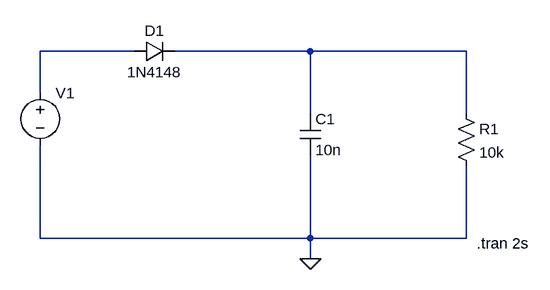
[diagram p0: schematic Diodo.asc]
Diodo.asc, the LTspice schematic file:
Version 4
SHEET 1 880 680
WIRE 112 160 -32 160
WIRE 384 160 176 160
WIRE 624 160 384 160
WIRE -32 224 -32 160
WIRE 384 256 384 160
WIRE 624 256 624 160
WIRE -32 448 -32 304
WIRE 384 448 384 320
WIRE 384 448 -32 448
WIRE 624 448 624 336
WIRE 624 448 384 448
WIRE 384 480 384 448
FLAG 384 480 0
SYMBOL res 608 240 R0
SYMATTR InstName R1
SYMATTR Value 10k
SYMBOL cap 368 256 R0
SYMATTR InstName C1
SYMATTR Value 10n
SYMBOL diode 112 176 R270
WINDOW 0 32 32 VTop 2
WINDOW 3 0 32 VBottom 2
SYMATTR InstName D1
SYMATTR Value 1N4148
SYMBOL voltage -32 208 R0
WINDOW 3 24 96 Invisible 2
SYMATTR Value wavefile = ExpSweep.wav
SYMATTR InstName V1
TEXT 640 456 Left 2 !.tran 2s

The netlist it stands for:
* Diodo.asc
R1 N002 0 10k
C1 N002 0 10n
D1 N001 N002 1N4148
V1 N001 0 wavefile = ExpSweep.wav
.model D D
.lib standard.dio
.tran 2s
.backanno
.end